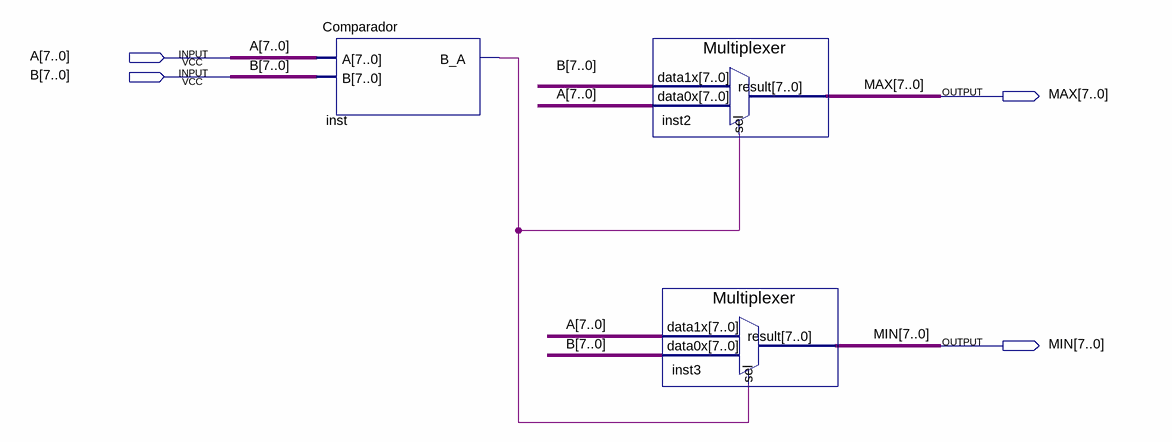
[diagram p0: schematic sheet]
// Quartus schematic Max2.bdf as structural Verilog: 3 symbols, 4 pins
module Max2 (
  input  [7:0] A,
  input  [7:0] B,
  output [7:0] MAX,
  output [7:0] MIN
);

  wire inst_b_a;

  Comparador inst (.A(A), .B(B), .B_A(inst_b_a));
  Multiplexer inst2 (.data1x(B), .data0x(A), .sel(inst_b_a), .result(MAX));
  Multiplexer inst3 (.data1x(A), .data0x(B), .sel(inst_b_a), .result(MIN));
endmodule
